# EAGLE design xtend breakout (EAGLE 6.4)
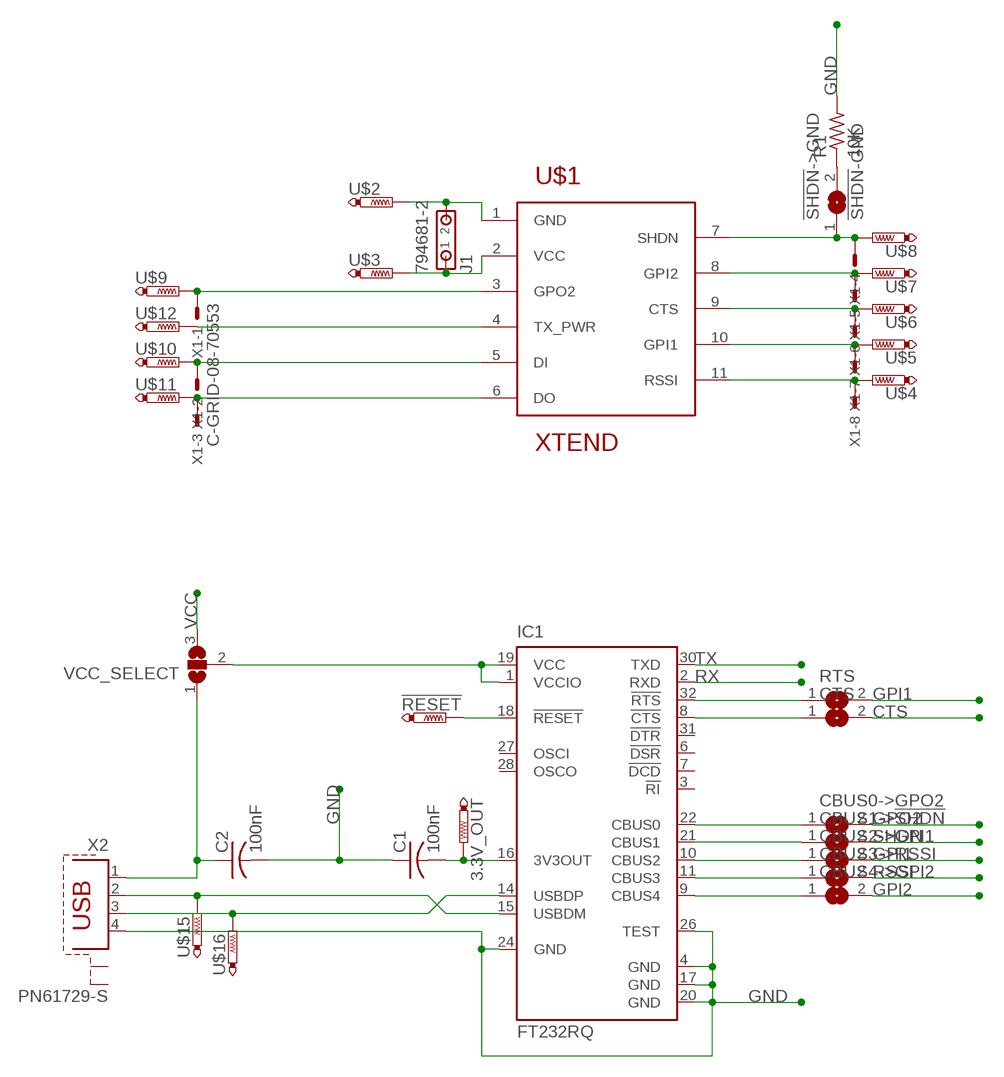
[diagram p0: schematic, sheet 1]

## Parts
3.3V_OUT  TESTPAD-20MIL  [20MIL]
!RESET!  TESTPAD-20MIL  [20MIL]
!SHDN!->GND  !SHDN!-GND  SJ  [SJ]
C1  100nF  C-USC1206  [C1206]
C2  100nF  C-USC1206  [C1206]
CBUS0->GPO2  SJ  [SJ]
CBUS1->!SHDN!  SJ  [SJ]
CBUS2->GPI1  SJ  [SJ]
CBUS3->RSSI  SJ  [SJ]
CBUS4->GPI2  SJ  [SJ]
CTS  SJ  [SJ]
IC1  FT232RQ  [QFN32]
J1  794681-2  [794681-2]
R1  10K  R-US_R1206  [R1206]
RTS  SJ  [SJ]
U$1  XTEND  [XTEND]
U$2  TESTPAD-20MIL  [20MIL]
U$3  TESTPAD-20MIL  [20MIL]
U$4  TESTPAD-20MIL  [20MIL]
U$5  TESTPAD-20MIL  [20MIL]
U$6  TESTPAD-20MIL  [20MIL]
U$7  TESTPAD-20MIL  [20MIL]
U$8  TESTPAD-20MIL  [20MIL]
U$9  TESTPAD-20MIL  [20MIL]
U$10  TESTPAD-20MIL  [20MIL]
U$11  TESTPAD-20MIL  [20MIL]
U$12  TESTPAD-20MIL  [20MIL]
U$15  TESTPAD-20MIL  [20MIL]
U$16  TESTPAD-20MIL  [20MIL]
VCC_SELECT  SJ2W  [SJ_2]
X1  C-GRID-08-70553  [70553-08]
X2  PN61729-S  [PN61729-S]

## Nets
CTS: CTS.2 U$1.9(CTS) U$6.P$1(TP) X1.6
GND [SMALL]: C1.1 C2.2 IC1.4(GND) IC1.17(GND) IC1.20(GND) IC1.24(GND) IC1.26(TEST) J1.2 R1.2 U$1.1(GND) U$2.P$1(TP) X2.4
GPI1: CBUS2->GPI1.2 RTS.2 U$1.10(GPI1) U$5.P$1(TP) X1.7
GPI2: CBUS4->GPI2.2 U$1.8(GPI2) U$7.P$1(TP) X1.5
GPO2: CBUS0->GPO2.2 U$1.3(GPO2) U$9.P$1(TP) X1.1
N$1 [SMALL]: IC1.32(!RTS) RTS.1
N$2 [SMALL]: CTS.1 IC1.8(!CTS)
N$3: !SHDN!->GND.2 R1.1
N$4 [SMALL]: CBUS0->GPO2.1 IC1.22(CBUS0)
N$5 [SMALL]: CBUS1->!SHDN!.1 IC1.21(CBUS1)
N$6 [SMALL]: CBUS2->GPI1.1 IC1.10(CBUS2)
N$7 [SMALL]: CBUS3->RSSI.1 IC1.11(CBUS3)
N$8 [SMALL]: CBUS4->GPI2.1 IC1.9(CBUS4)
N$9 [SMALL]: IC1.1(VCCIO) IC1.19(VCC) VCC_SELECT.2
N$11 [SMALL]: 3.3V_OUT.P$1(TP) C1.2 IC1.16(3V3OUT)
N$13 [SMALL]: !RESET!.P$1(TP) IC1.18(!RESET)
RSSI: CBUS3->RSSI.2 U$1.11(RSSI) U$4.P$1(TP) X1.8
RX [SMALL]: IC1.2(RXD) U$1.6(DO) U$11.P$1(TP) X1.3
SHDN: !SHDN!->GND.1 CBUS1->!SHDN!.2 U$1.7(SHDN) U$8.P$1(TP) X1.4
TX [SMALL]: IC1.30(TXD) U$1.5(DI) U$10.P$1(TP) X1.2
TX_PWR: U$1.4(TX_PWR) U$12.P$1(TP)
USB_VCC: C2.1 VCC_SELECT.1 X2.1
USBDM [SMALL]: IC1.15(USBDM) U$15.P$1(TP) X2.2
USBDP [SMALL]: IC1.14(USBDP) U$16.P$1(TP) X2.3
VCC [Power]: J1.1 U$1.2(VCC) U$3.P$1(TP) VCC_SELECT.3
Unconnected: IC1.3(!RI) IC1.6(!DSR) IC1.7(!DCD) IC1.27(OSCI) IC1.28(OSCO) IC1.31(!DTR) X2.S1 X2.S2

## Library data of the parts
3.3V_OUT !RESET! U$2-U$12 U$15 U$16 = LTC6803:TESTPAD-20MIL
!SHDN!->GND CBUS0->GPO2 CBUS1->!SHDN! CBUS2->GPI1 CBUS3->RSSI CBUS4->GPI2 CTS RTS = jumper:SJ: SMD solder JUMPER
C1 C2 = rcl:C-US: CAPACITOR, American symbol
IC1 = ftdichip:FT232R: Source: http://www.ftdichip.com/Documents/DataSheets/DS_FT232R_v104.pdf; MPN: FT232RQ; OC_FARNELL: 1146033; OC_NEWARK: 91K9919
J1 = con-amp:794681-2: Micro MATE-N-LOK Connectors grid 1.5mm Dual Row Through Hole Vertical Metal Through Hole Holddowns Source: ENG_CD_794681_E.pdf
R1 = rcl:R-US_: RESISTOR, American symbol
U$1 = SolarJackets_Common:XTEND
VCC_SELECT = jumper:SJ2W: SMD solder JUMPER
X1 = con-molex:C-GRID-08: CONNECTOR wire to board 2.54 mm (0.100") pitch header; OC_FARNELL: unknown; OC_NEWARK: unknown
X2 = con-berg:PN61729-S: BERG USB connector; OC_FARNELL: unknown; OC_NEWARK: unknown

## Net classes
1 Power: width 1.27 mm, drill 0.508 mm
2 SMALL: width 0.178 mm

## Board
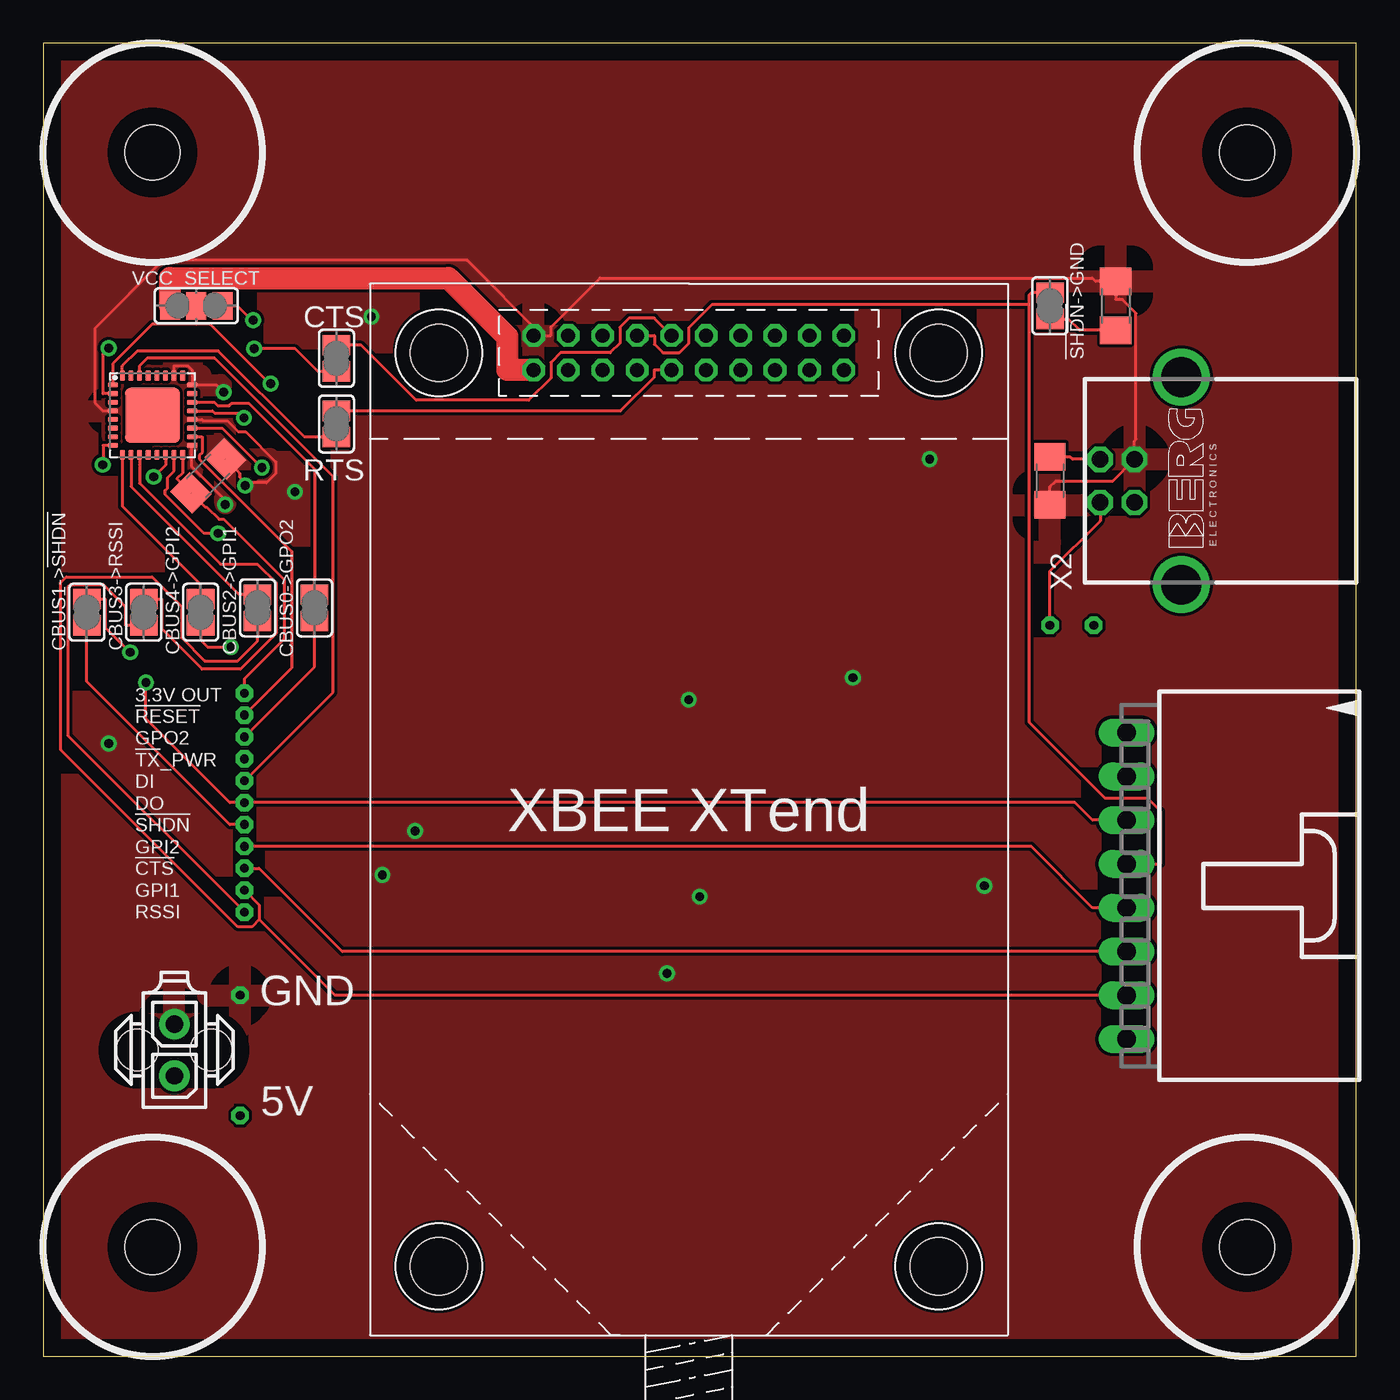
[diagram p1: board, top side]
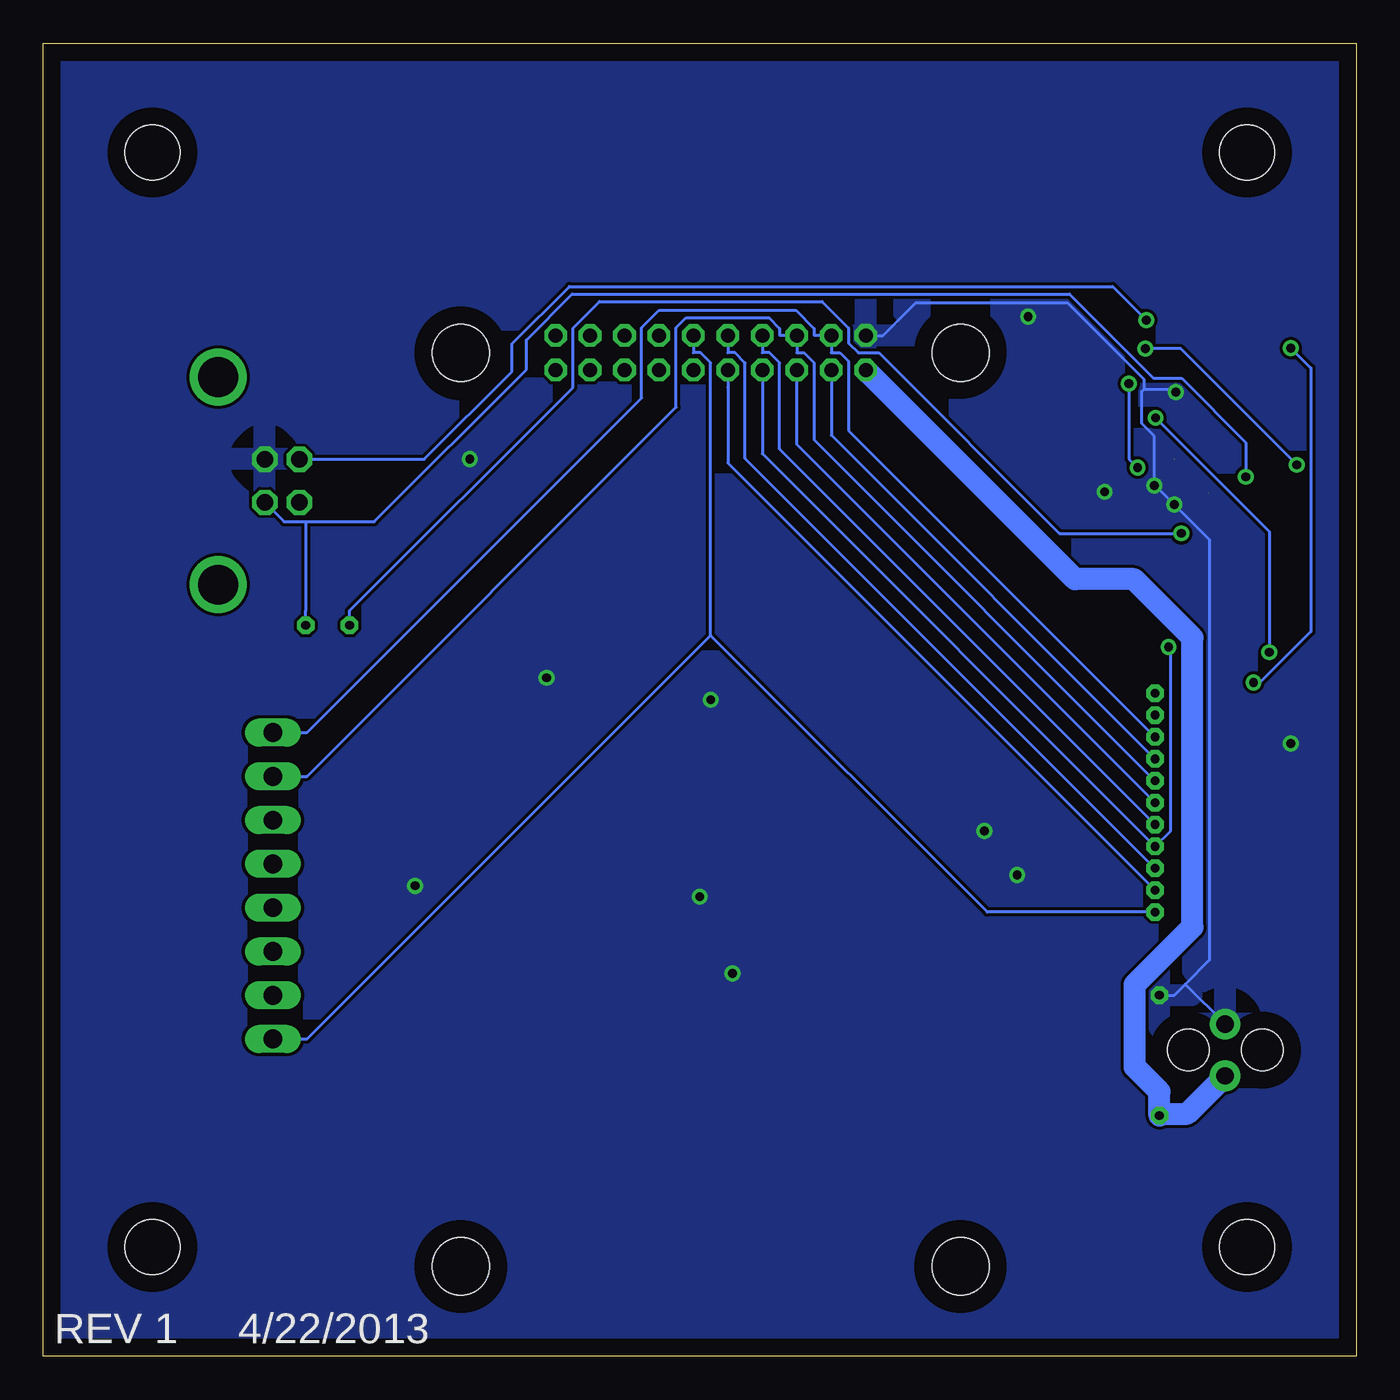
[diagram p2: board, bottom side, seen from below]

Size 76.2 x 76.2 mm. Coordinates in mm from the lower left corner, seen from the top.
Outline: 0,0 76.2,0 76.2,76.2 0,76.2 0,0
Copper layers (1*16): Top 0.035mm / dielectric 1.5mm / Bottom 0.035mm
Design rules "SJ Design Rules *": minimum track width 7mil, minimum drill 20mil, track to track 7mil, track to pad 7mil, pad to pad 7mil, via to via 10mil, smd to smd 7mil, copper to edge 40mil, drill to drill 10mil, minimum pad ring 10mil, minimum via ring 8mil, stop-mask expansion 4mil, vias tented up to drill 0mil, thermal gap 50mil
Holes 3.17 mm at 6.35,69.85 69.85,6.35 6.35,6.35 69.85,69.85
tRestrict: area 20.4,55.8 to 25.5,60.8; area 49.4,2.7 to 54.5,7.7; area 49.4,55.6 to 54.5,60.7; area 20.4,2.7 to 25.5,7.7
bRestrict: area 49.4,55.6 to 54.5,60.7; area 20.4,2.7 to 25.5,7.7; area 20.4,55.8 to 25.5,60.8; area 49.4,2.7 to 54.5,7.7

### Footprints (pad centres in the part's own frame; a part is rotated, then mirrored left to right if it is on the bottom)
20MIL = drill 0.508 octagon: P$1 0,0
SJ = smd 1.168 x 1.6: 1 -0.762,0; 2 0.762,0
C1206 = smd 1.6 x 1.8: 1 -1.4,0; 2 1.4,0
QFN32 = smd 0.6 x 0.3: 1 -2.3,1.75; 2 -2.3,1.25; 3 -2.3,0.75; 4 -2.3,0.25; 5 -2.3,-0.25; 6 -2.3,-0.75; 7 -2.3,-1.25; 8 -2.3,-1.75; 17 2.3,-1.75; 18 2.3,-1.25; 19 2.3,-0.75; 20 2.3,-0.25; 21 2.3,0.25; 22 2.3,0.75; 23 2.3,1.25; 24 2.3,1.75 | smd 0.3 x 0.6: 9 -1.75,-2.3; 10 -1.25,-2.3; 11 -0.75,-2.3; 12 -0.25,-2.3; 13 0.25,-2.3; 14 0.75,-2.3; 15 1.25,-2.3; 16 1.75,-2.3; 25 1.75,2.3; 26 1.25,2.3; 27 0.75,2.3; 28 0.25,2.3; 29 -0.25,2.3; 30 -0.75,2.3; 31 -1.25,2.3; 32 -1.75,2.3 | smd 3.2 x 3.2: EXP 0,0
794681-2 = drill 1 pad 1.778: 1 0,-1.5; 2 0,1.5 | hole 2.4: 2.13,0; -2.17,0
R1206 = smd 1.6 x 1.803: 1 -1.422,0; 2 1.422,0
XTEND = drill 0.8 octagon: 1 9,3; 2 9,5; 3 7,3; 4 7,5; 5 5,3; 6 5,5; 7 3,3; 8 3,5; 9 1,3; 10 1,5; 11 -1,3; 12 -1,5; 13 -3,3; 14 -3,5; 15 -5,3; 16 -5,5; 17 -7,3; 18 -7,5; 19 -9,3; 20 -9,5 | hole 3.3: -14.5,57; 14.5,57; -14.5,4; 14.5,4
SJ_2 = smd 1.168 x 1.6: 1 -1.524,0; 2 0,0; 3 1.524,0
70553-08 = drill 1.092 long: 1 -8.89,-7.62; 2 -6.35,-7.62; 3 -3.81,-7.62; 4 -1.27,-7.62; 5 1.27,-7.62; 6 3.81,-7.62; 7 6.35,-7.62; 8 8.89,-7.62
PN61729-S = drill 0.95 octagon: 1 1.25,4.71; 2 -1.25,4.71; 3 -1.25,2.71; 4 1.25,2.71 | drill 2.3 pad 2.9: S1 -6.02,0; S2 6.02,0

### Placement (x,y rotation side)
3.3V_OUT  11.68,38.48 0 top
!RESET!  11.68,37.21 0 top
!SHDN!->GND  58.42,60.96 270 top
C1  9.58,51.08 225 top
C2  58.42,50.8 270 top
CBUS0->GPO2  15.75,43.43 270 top
CBUS1->!SHDN!  2.54,43.18 270 top
CBUS2->GPI1  12.45,43.43 270 top
CBUS3->RSSI  5.84,43.18 270 top
CBUS4->GPI2  9.14,43.18 270 top
CTS  17.02,57.91 90 top
IC1  6.35,54.61 0 top
J1  7.62,17.78 0 top
R1  62.23,60.96 90 top
RTS  17.02,54.1 90 top
U$1  37.47,62.23 180 top
U$2  11.43,20.95 0 top
U$3  11.43,13.97 0 top
U$4  11.68,25.78 0 top
U$5  11.68,27.05 0 top
U$6  11.68,28.32 0 top
U$7  11.68,29.59 0 top
U$8  11.68,30.86 0 top
U$9  11.68,35.94 0 top
U$10  11.68,33.4 0 top
U$11  11.68,32.13 0 top
U$12  11.68,34.67 0 top
U$15  58.42,42.42 0 top
U$16  60.96,42.42 0 top
VCC_SELECT  8.89,60.96 180 top
X1  70.48,27.3 270 top
X2  66.04,50.8 90 top

### Tracks (layer width: path | path; a pad name or v marks a point on that pad's centre or on a via)
CTS
  Top 0.178: U$6.P$1 12.54,28.32 17.36,23.5 X1.6 | U$1.9 35.45,60.24 34,60.24 33.46,59.71 33.46,58.78 32.91,58.23 30.02,58.23 29.46,57.67 29.46,56.77 28.18,55.48 21.65,55.48 18.46,58.67 CTS.2
  Bottom 0.178: U$6.P$1 35.47,52.1 35.47,57.64 36.05,58.23 36.47,58.23 U$1.9
GND  (via drill 0.51 pad 0.91)  (1 unrouted)
  Top 0.178: IC1.20 9.22,54.36 9.28,54.29 10.69,54.29 11.32,53.66 11.74,53.66 13.51,51.89 13.51,51.23 12.97,50.7 11.73,50.7 | v10.47,55.96 10.07,56.36 IC1.24 8.65,57.23 8.4,57.48 7.6,57.48 IC1.26 | 11.39,51.25 | 11.39,51.25 11.39,51.03 11.73,50.7 | v11.73,50.53 11.73,50.7 | C1.1 11.39,51.25 | IC1.17 8.59,52.8 8.59,51.66 10.57,49.69 v10.57,49.42 | v10.57,49.42 | IC1.4 3.48,54.86 3,55.35 3,59.64 6.95,63.59 24.6,63.59 28.96,59.23 | 28.96,59.23 29.46,59.23 29.46,59.73 32.31,62.57 60.87,62.57 61.06,62.38 R1.2 62.23,61.31 62.63,61.31 63.41,60.53 63.41,53.21 63.33,53.12 X2.4 62.08,50.8 58.75,50.8 58.42,50.47 C2.2 | U$1.1 28.96,59.23
  Bottom 0.178: 12.31,56.12 10.64,56.12 v10.47,55.96 | 12.31,56.12 12.31,56.68 16.73,61.1 25.59,61.1 27.47,59.23 U$1.1 | 12.31,56.12 12.45,55.98 12.45,54.13 11.73,53.4 v11.73,50.53 11.68,50.53 v10.57,49.42 8.53,47.38 8.53,23 9.94,21.6 | 9.94,21.6 J1.2 | 9.94,21.6 10.58,20.95 U$2.P$1
  other vias: 37.47,38.1 46.99,39.37 38.1,26.67 54.61,27.3 19.68,27.94 36.2,22.23 21.59,30.48 3.81,35.56 14.61,50.16 51.44,52.07 19.05,60.33
  pour Top: 1.27,74.93 74.93,74.93 74.93,1.27 1.27,1.27
  pour Bottom: 1.27,74.93 74.93,74.93 74.93,1.27 1.27,1.27
GPI1
  Top 0.178: 12.55,25.35 12.12,24.93 11.29,24.93 1.02,35.2 1.02,44.9 1.35,45.23 6.33,45.23 8.04,43.52 8.04,41.7 9.38,40.35 11.29,40.35 12.45,41.51 12.45,41.82 CBUS2->GPI1.2 | U$5.P$1 12.55,26.19 12.55,25.35 | X1.7 16.94,20.95 12.55,25.35 | RTS.2 18.09,54.86 33.52,54.86 35.47,56.82 35.47,57.23 U$1.10
  Bottom 0.178: U$5.P$1 36.47,51.83 36.47,56.23 U$1.10
GPI2  (via drill 0.51 pad 0.91)
  Top 0.178: X1.5 60.88,26.04 57.33,29.59 U$7.P$1 | v10.89,41.16 9.55,41.16 9.14,41.57 CBUS4->GPI2.2
  Bottom 0.178: U$1.8 34.47,52.37 U$7.P$1 10.78,30.49 10.78,41.04 v10.89,41.16
GPO2
  Top 0.178: U$9.P$1 15.75,40.01 CBUS0->GPO2.2
  Bottom 0.178: X1.1 60.88,36.2 41.47,55.61 41.47,59.69 40.45,60.7 32.52,60.7 31.46,59.64 31.46,59.23 U$1.3 30.46,58.23 29.97,58.23 29.47,57.73 29.47,53.73 U$9.P$1
N$1
  Top 0.178: RTS.1 15.95,53.34 15.17,53.34 10.17,58.34 5.46,58.34 4.6,57.48 IC1.32
N$2  (via drill 0.51 pad 0.91)
  Top 0.178: v12.24,58.47 14.64,58.47 15.95,57.15 CTS.1 | v3.46,51.73 3.48,51.76 3.48,52.86 IC1.8
  Bottom 0.178: v3.46,51.73 10.19,58.47 v12.24,58.47
N$3
  Top 0.178: !SHDN!->GND.2 59.49,60.2 60.15,59.54 R1.1
N$4
  Top 0.178: IC1.22 9.22,55.36 9.94,55.36 10.14,55.16 10.8,55.16 10.96,55.31 11.94,55.31 15.75,51.5 15.75,45.05 CBUS0->GPO2.1
N$5  (via drill 0.51 pad 0.91)
  Top 0.178: IC1.21 9.83,54.86 9.96,54.72 11.39,54.72 v11.65,54.46 | v5.05,40.85 3.61,42.29 3.61,43.94 CBUS1->!SHDN!.1
  Bottom 0.178: v11.65,54.46 5.05,47.86 v5.05,40.85 | v5.05,40.85
N$6
  Top 0.178: CBUS2->GPI1.1 11.38,44.2 5.1,50.48 IC1.10
N$7
  Top 0.178: CBUS3->RSSI.1 6.91,43.94 6.91,42.19 9.22,39.88 11.46,39.88 13.51,41.93 13.51,44.89 12.43,45.97 10.29,45.97 5.6,50.66 5.6,51.74 IC1.11
N$8
  Top 0.178: CBUS4->GPI2.1 9.14,44.79 4.6,49.34 IC1.9
N$9  (via drill 0.51 pad 0.91)
  Top 0.178: v12.7,51.56 10.4,53.86 9.22,53.86 IC1.19 | v13.2,56.44 13.14,56.44 9.68,59.89 8.89,59.89 | VCC_SELECT.2 8.89,59.89 | 8.89,59.89 6.34,59.89 4.05,57.6 IC1.1
  Bottom 0.178: v13.2,56.44 13.2,52.07 v12.7,51.56
N$11  (1 unrouted)
  Top 0.178: 9.41,49.27 | 9.41,49.27 9.51,49.27 10.21,48.57 10.48,48.57 13.98,45.07 13.98,41.63 11.68,39.33 3.3V_OUT.P$1 | IC1.16 8.1,51.26 7.76,50.92 C1.2 9.41,49.27
N$13
  Top 0.178: !RESET!.P$1 14.42,39.95 14.42,46.7 9.06,52.07 9.06,52.28 9.22,52.44 9.22,53.36 IC1.18
RSSI
  Top 0.178: CBUS3->RSSI.2 4.78,42.42 4.78,43.5 3.48,44.79 1.6,44.79 1.47,44.67 1.47,35.99 U$4.P$1
  Bottom 0.178: 37.47,41.83 37.47,57.65 38.05,58.23 38.47,58.23 U$1.11 | 37.47,41.83 60.88,18.41 X1.8 | U$4.P$1 21.41,25.78 37.47,41.83
RX  (via drill 0.51 pad 0.91)
  Top 0.178: v5.96,39.1 5.96,37 10.83,32.13 U$11.P$1 59.87,32.13 60.88,31.11 X1.3 | v3.8,58.5 3.48,58.18 3.48,55.86 IC1.2
  Bottom 0.178: v3.8,58.5 2.65,57.34 2.65,42.05 5.6,39.1 v5.96,39.1 | U$11.P$1 32.47,52.91 U$1.6
SHDN
  Top 0.178: U$1.7 35.46,59.23 35.46,58.73 35.96,58.23 36.91,58.23 37.47,58.79 37.47,59.69 38.83,61.05 57.22,61.05 | 57.22,61.05 57.22,61.59 57.35,61.72 !SHDN!->GND.1 | 57.22,61.05 57.22,36.79 61.63,32.38 64.09,32.38 64.85,31.63 64.85,28.57 X1.4 | CBUS1->!SHDN!.2 2.54,39.15 10.83,30.86 U$8.P$1
  Bottom 0.178: U$1.7 34.47,58.23 34.05,58.23 33.47,57.65 33.47,52.65 U$8.P$1
TX
  Top 0.178: U$10.P$1 16.82,38.53 16.82,51.04 9.95,57.91 6.03,57.91 5.6,57.48 IC1.30
  Bottom 0.178: X1.2 60.88,33.66 39.47,55.07 39.47,59.68 38.89,60.26 34.08,60.26 33.46,59.64 33.46,59.23 U$1.5 32.47,58.23 32.05,58.23 31.46,57.65 31.46,53.18 U$10.P$1
TX_PWR
  Bottom 0.178: U$1.4 30.46,53.45 U$12.P$1
USB_VCC  (via drill 0.51 pad 0.91)
  Top 0.178: C2.1 59.59,52.2 59.74,52.05 X2.1 | VCC_SELECT.1 11.27,60.96 12.09,60.13 v12.19,60.13
  Bottom 0.178: v12.19,60.13 14.14,62.08 45.66,62.08 48.99,58.75 48.99,57.14 54.08,52.05 60.26,52.05 X2.1
USBDM  (via drill 0.51 pad 0.91)
  Top 0.178: v10.15,47.75 9.35,47.75 7.08,50.02 7.08,50.24 7.22,50.38 7.22,50.99 7.6,51.37 IC1.15 | U$15.P$1 58.42,45.57 61.33,48.48 X2.2
  Bottom 0.178: U$15.P$1 58.42,43.27 45.47,56.22 45.47,59.66 43.92,61.2 31,61.2 29.46,59.66 29.46,58.79 28.91,58.23 27.7,58.23 17.23,47.75 v10.15,47.75
USBDP  (via drill 0.51 pad 0.91)
  Top 0.178: IC1.14 7.1,51.72 v6.42,51.04
  Bottom 0.178: 60.96,48.44 56.98,48.44 48.16,57.26 48.16,58.97 45.5,61.63 16.65,61.63 11.77,56.76 10.14,56.76 6.42,53.03 v6.42,51.04 | 60.96,48.44 60.96,43.27 U$16.P$1 | X2.3 62.22,48.44 60.96,48.44
VCC
  Top 1.27: U$1.2 26.92,57.23 26.92,59.17 23.52,62.57 7.37,62.57 VCC_SELECT.3
  Bottom 1.27: 11.43,14.08 9.82,14.08 J1.1 | 11.43,14.08 11.43,15.37 12.86,16.79 12.86,21.57 9.52,24.91 9.52,41.7 12.9,45.09 16.33,45.09 U$1.2 | U$3.P$1 11.43,14.08

### Text on the board
tPlace: 3.3V OUT / !RESET! / GPO2 / !TX!_PWR / DI / DO / !SHDN! / GPI2 / !CTS! / GPI1 / RSSI | GND | 5V
bNames: REV 1 4/22/2013
tValues: Wireless Telemetry Breakout | EXT | USB | All parts in the top left corner, / the USB jack and the 100nF / capacitor should only be soldered / if intending to use USB. (Chase car only) | USBDM / / USBDP